# EasyEDA Pro project ProDoc_MotherBrd_2025-10-13.epro, board PCB1
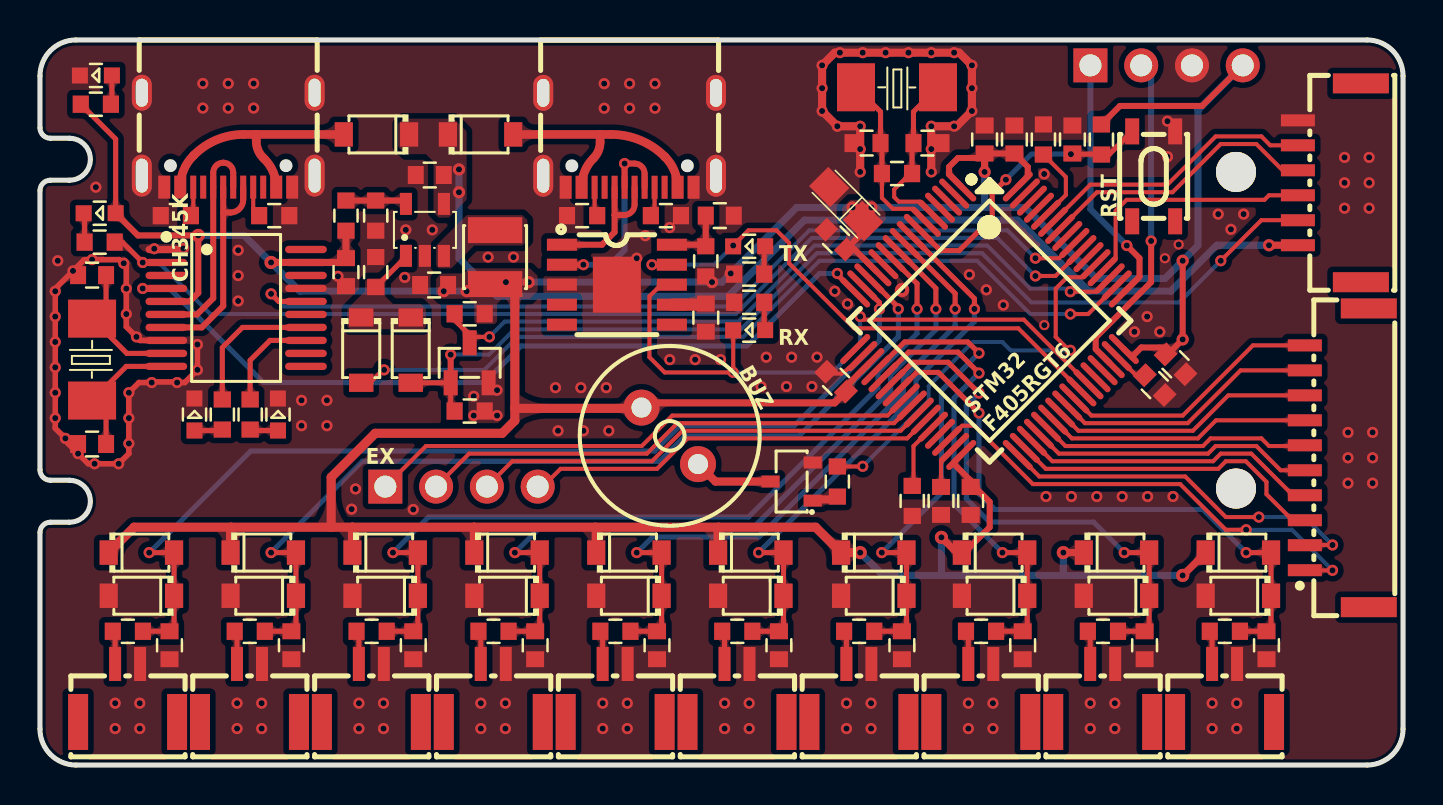
[diagram p1: board, top side]
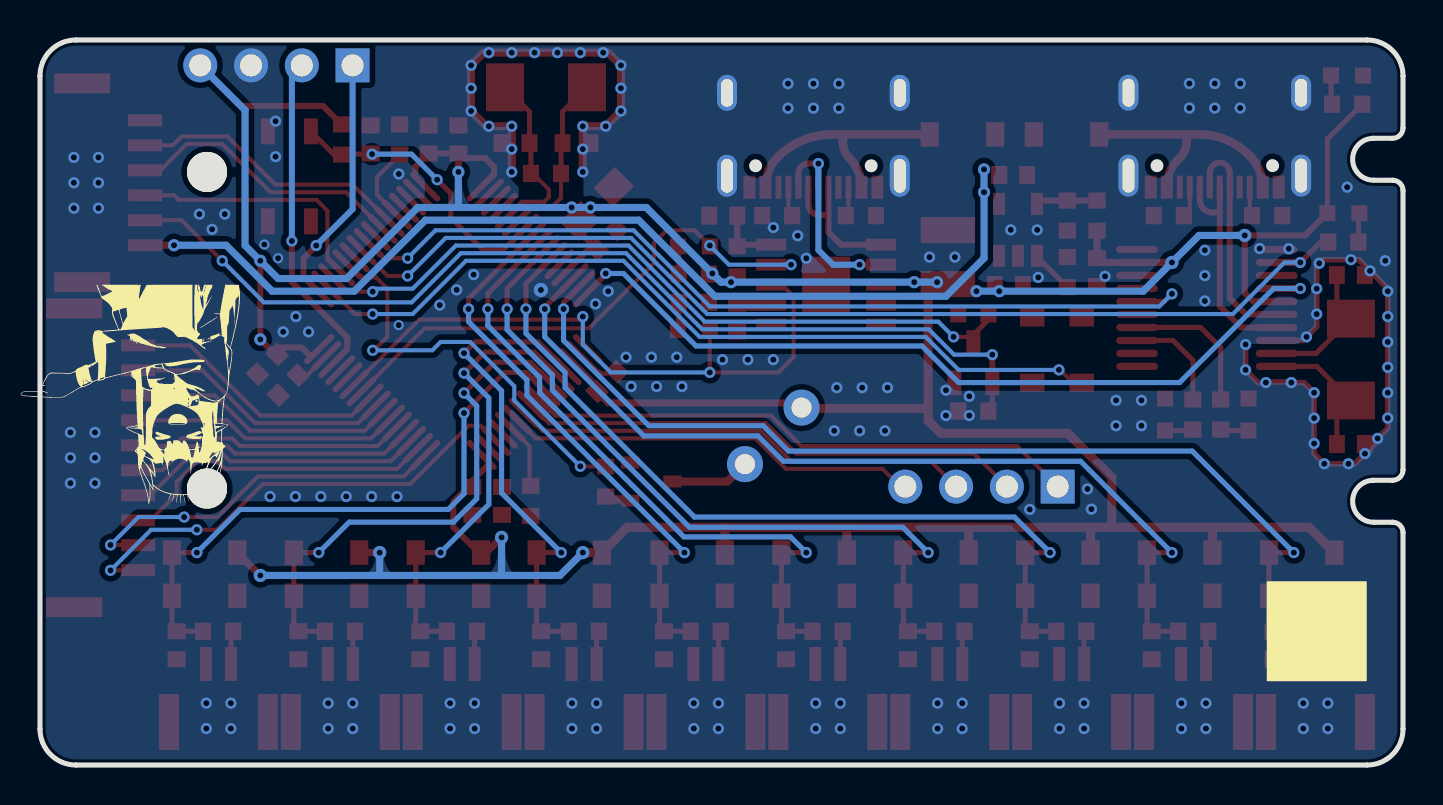
[diagram p2: board, bottom side, seen from below]

Outline 68.17 x 36.28 mm; copper layers: Top Layer, Bottom Layer. Coordinates in mm from the lower left corner of the outline.
Outline path: 0,34.48 0,31.89 arc(0.15,31.52) 0.52,31.37 1.47,31.37 arc(2.52,30.32) 1.47,29.27 0.52,29.27 arc(0.15,29.11) 0,28.75 0,14.77 arc(0.15,14.4) 0.52,14.25 1.47,14.25 arc(2.52,13.2) 1.47,12.15 0.52,12.15 arc(0.15,12) 0,11.63 0,1.8 arc(0.53,0.53) 1.8,0 66.37,0 arc(67.64,0.53) 68.17,1.8 68.17,34.48 arc(67.64,35.76) 66.37,36.28 1.8,36.28 arc(0.53,35.76) 0,34.48
Stack: Top Layer 0.035mm / Dielectric1 1.51mm FR4 er 4.5 / Bottom Layer 0.035mm

## Design rules (mm)
net OSC_IN: DP1
net OSC_OUT: DP1
net $1N4523: DP2
net $1N4525: DP2
template: 自定义配置
spacing copperThickness1oz (default): track to track 0.102, other pairs 0.152 to 0.3
spacing copperThickness2oz: track to track 0.203, other pairs 0.152 to 0.3
track width copperThickness1oz (default): min 0.127, default 0.254, max 2.54
track width copperThickness2oz: min 0.203, default 0.254, max 2.54
differential pair differentialPair (default): width min 0.127, default 0.254, max 2.54; gap min 0.152, default 0.152
via viaSize (default): diameter min 0.5, default 0.61, max 10; hole min 0.3, default 0.305, max 6.3

## Placement (name value [footprint] x y rotation side)
BUZ  2.7kHz  [BUZ-TH_BD9.0-P4.00-D0.6-FD]  31.5 16.47 315 top
C1  2.2uF  [C0603]  45.06 13.22 270 top
C2  2.2uF  [C0603]  55.75 19.01 315 top
C3  22pF  [C0603]  44.39 31.12 180 top
C4  22pF  [C0603]  41.34 31.12 0 top
C5  10uF  [C0603]  51.64 31.3 90 top
C6  100nF  [C0603]  47.24 31.3 270 top
C7  100nF  [C0603]  39.81 19.19 315 top
C8  100nF  [C0603]  46.55 13.22 90 top
C9  100nF  [C0603]  56.79 20.05 135 top
C10  100nF  [C0603]  48.73 31.3 270 top
C11  1uF  [CASE-A_3216]  40.32 28.08 135 top
C12  100nF  [C0603]  39.81 26.3 315 top
C13  22uF  [C0603]  19.49 29.53 0 top
C14  22uF  [C0603]  19.71 24.02 0 top
C15  22pF  [C0603]  2.61 24.52 0 top
C16  22pF  [C0603]  2.61 16.06 0 top
C17  100nF  [C0603]  15.3 24.67 270 top
C18  100nF  [C0603]  34 27.49 180 top
C19  100nF  [C0603]  33.3 22.39 90 top
C20  22nF  [C0603]  36.96 5.99 90 top
C21  22nF  [C0603]  61.34 5.99 90 top
C22  22nF  [C0603]  55.25 5.99 90 top
C23  22nF  [C0603]  49.15 5.99 90 top
C24  22nF  [C0603]  43.11 5.99 90 top
C25  22nF  [C0603]  6.48 5.99 90 top
C26  22nF  [C0603]  12.57 5.99 90 top
C27  22nF  [C0603]  18.67 5.99 90 top
C28  22nF  [C0603]  24.76 5.99 90 top
C29  22nF  [C0603]  30.86 5.99 90 top
C.HIHAT  -  [CONN-TH_2P-P1.25_XUNPU_WAFER-GH1.25-2PWB]  47.05 3.61 0 top
CH345K  -  [SSOP-20_L7.2-W5.3-P0.65-LS7.8-BL]  9.81 22.87 270 top
CRUSH  -  [CONN-TH_2P-P1.25_XUNPU_WAFER-GH1.25-2PWB]  53.15 3.61 0 top
D1  1N5819W S4  [SOD-123_L2.7-W1.6-LS3.7-RD]  16.83 31.56 180 top
D2  1N5819W S4  [SOD-123_L2.7-W1.6-LS3.7-RD]  22.03 31.56 0 top
D3  1N5819W S4  [SOD-123_L2.7-W1.6-LS3.7-RD]  18.54 20.76 270 top
D4  1N5819W S4  [SOD-123_L2.7-W1.6-LS3.7-RD]  16.07 20.76 270 top
D5  1N5819W S4  [SOD-123_L2.7-W1.6-LS3.7-RD]  35.55 10.63 0 top
D6  1N5819W S4  [SOD-123_L2.7-W1.6-LS3.7-RD]  35.55 8.47 180 top
D7  1N5819W S4  [SOD-123_L2.7-W1.6-LS3.7-RD]  59.93 10.63 0 top
D8  1N5819W S4  [SOD-123_L2.7-W1.6-LS3.7-RD]  59.93 8.47 180 top
D9  1N5819W S4  [SOD-123_L2.7-W1.6-LS3.7-RD]  53.84 10.63 0 top
D10  1N5819W S4  [SOD-123_L2.7-W1.6-LS3.7-RD]  53.84 8.47 180 top
D11  1N5819W S4  [SOD-123_L2.7-W1.6-LS3.7-RD]  47.74 10.63 0 top
D12  1N5819W S4  [SOD-123_L2.7-W1.6-LS3.7-RD]  47.74 8.47 180 top
D13  1N5819W S4  [SOD-123_L2.7-W1.6-LS3.7-RD]  41.7 10.63 0 top
D14  1N5819W S4  [SOD-123_L2.7-W1.6-LS3.7-RD]  41.7 8.47 180 top
D15  1N5819W S4  [SOD-123_L2.7-W1.6-LS3.7-RD]  5.07 10.63 0 top
D16  1N5819W S4  [SOD-123_L2.7-W1.6-LS3.7-RD]  5.07 8.47 180 top
D17  1N5819W S4  [SOD-123_L2.7-W1.6-LS3.7-RD]  11.17 10.63 0 top
D18  1N5819W S4  [SOD-123_L2.7-W1.6-LS3.7-RD]  11.17 8.47 180 top
D19  1N5819W S4  [SOD-123_L2.7-W1.6-LS3.7-RD]  17.26 10.63 0 top
D20  1N5819W S4  [SOD-123_L2.7-W1.6-LS3.7-RD]  17.26 8.47 180 top
D21  1N5819W S4  [SOD-123_L2.7-W1.6-LS3.7-RD]  23.36 10.63 0 top
D22  1N5819W S4  [SOD-123_L2.7-W1.6-LS3.7-RD]  23.36 8.47 180 top
D23  1N5819W S4  [SOD-123_L2.7-W1.6-LS3.7-RD]  29.45 10.63 0 top
D24  1N5819W S4  [SOD-123_L2.7-W1.6-LS3.7-RD]  29.45 8.47 180 top
EX  -  [HDR-TH_4P-P2.54-V-F]  21.08 13.93 0 top
FL. TOM  -  [CONN-TH_2P-P1.25_XUNPU_WAFER-GH1.25-2PWB]  4.38 3.61 0 top
HI. TOM  -  [CONN-TH_2P-P1.25_XUNPU_WAFER-GH1.25-2PWB]  16.57 3.61 0 top
KICK  WAFER-GH1.25-2PWB  [CONN-TH_2P-P1.25_XUNPU_WAFER-GH1.25-2PWB]  28.77 3.61 0 top
L1  2.2uH  [IND-SMD_L3.0-W3.0_FNR30XXS]  22.76 25.42 90 top
MID TOM  -  [CONN-TH_2P-P1.25_XUNPU_WAFER-GH1.25-2PWB]  10.48 3.61 0 top
MIN  -  [LED0603]  11.91 17.49 270 top
MOUT  -  [LED0603]  7.73 17.49 270 top
O.HIHAT  -  [CONN-TH_2P-P1.25_XUNPU_WAFER-GH1.25-2PWB]  40.96 3.61 0 top
PAD_OUT  -  [CONN-SMD_10P-P1.25_XUNPU_WAFER-GH1.25-10PWB]  64.86 15.38 90 top
PWR  -  [LED0603]  2.85 34.51 0 top
Q1  AO3400  [SOT-23-3_L2.9-W1.3-P1.90-LS2.4-BR]  21.49 20.13 270 top
Q2  S9013  [SOT-23-3_L2.9-W1.4-P1.90-LS2.6-BR]  37.59 14.19 0 top
QR  -  [JLC-QRCODE-5x5]  4.32 6.69 180 bottom
R1  10K  [R0603]  50.19 31.3 90 top
R2  10K  [R0603]  43.62 13.22 90 top
R3  10K  [R0603]  53.09 31.3 270 top
R4  1M  [R0603]  42.86 29.6 0 top
R5  100K  [R0603]  16.79 24.67 270 top
R6  453K  [R0603]  15.3 27.49 270 top
R7  100K  [R0603]  16.79 27.49 90 top
R8  100K  [R0603]  21.49 22.58 0 top
R9  10K  [R0603]  21.49 17.72 180 top
R10  4.7K  [R0603]  2.79 33.07 180 top
R11  5.1K  [R0603]  6.79 27.49 180 top
R12  5.1K  [R0603]  11.71 27.49 0 top
R13  2K  [R0603]  2.98 26.17 0 top
R14  1K  [R0603]  9.12 17.54 270 top
R15  1K  [R0603]  10.51 17.54 270 top
R16  5.1K  [R0603]  27.11 27.49 180 top
R17  5.1K  [R0603]  31.31 27.49 0 top
R18  0Ω  [R0603]  33.3 25.21 90 top
R19  1K  [R0603]  35.47 24.57 180 top
R20  1K  [R0603]  35.47 23.16 180 top
R21  1K  [R0603]  39.88 14.19 270 top
R22  10K-68K  [R0603]  34.88 6.69 180 top
R23  10K-68K  [R0603]  59.26 6.69 180 top
R24  10K-68K  [R0603]  53.16 6.69 180 top
R25  10K-68K  [R0603]  47.07 6.69 180 top
R26  10K-68K  [R0603]  40.97 6.69 180 top
R27  10K-68K  [R0603]  4.39 6.69 180 top
R28  10K-68K  [R0603]  10.49 6.69 180 top
R29  10K-68K  [R0603]  16.59 6.69 180 top
R30  10K-68K  [R0603]  22.68 6.69 180 top
R31  10K-68K  [R0603]  28.78 6.69 180 top
RDY  -  [LED0603]  3.04 27.62 0 top
RIDE  WAFER-GH1.25-2PWB  [CONN-TH_2P-P1.25_XUNPU_WAFER-GH1.25-2PWB]  59.25 3.61 0 top
RST  K2-1808SN-A3SW-01  [SW-SMD_4P-L4.2-W3.3-P2.15-LS5.1]  55.7 29.46 90 top
RX  -  [LED0603]  35.52 21.77 0 top
S STICK  -  [CONN-TH_2P-P1.25_XUNPU_WAFER-GH1.25-2PWB]  34.86 3.61 0 top
SCREW1  -  [M2螺丝]  59.82 29.68 0 top
SCREW2  -  [M2螺丝]  59.82 13.84 0 top
SNARE  WAFER-GH1.25-2PWB  [CONN-TH_2P-P1.25_XUNPU_WAFER-GH1.25-2PWB]  22.67 3.61 0 top
STM32
F405RGT6  -  [LQFP-64_L10.0-W10.0-P0.50-LS12.0-BL]  47.49 22.23 225 top
SWD  -  [HDR-TH_4P-P2.54-V-F]  56.35 35.01 0 top
TX  -  [LED0603]  35.52 25.97 0 top
U2  TLV62568DBVR  [SOT-23-5_L3.0-W1.7-P0.95-LS2.8-BR]  19.25 26.78 270 top
U4  CH340K  [ESOP-10_L4.9-W3.9-P1.00-LS6.2-BL-EP]  28.85 24.04 270 top
UI  WAFER-GH1.25-6PWB  [CONN-SMD_6P-P1.25_XUNPU_WAFER-GH1.25-6PWB]  64.49 29.14 90 top
USB_MIDI  <-  -  [USB-C-SMD_TYPE-C16PIN]  9.41 31.28 180 top
USB_USART ->  -  [USB-C-SMD_TYPE-C16PIN]  29.49 31.28 180 top
X1  8MHz  [CRYSTAL-SMD_L5.0-W3.2]  42.86 33.92 0 top
X2  12MHz  [OSC-SMD_L5.0-W3.2]  2.61 20.29 270 top

## Footprints (pads in the part's own frame, mm; a bottom-side part is the same pattern mirrored in y, then rotated)
BUZ-TH_BD9.0-P4.00-D0.6-FD
  round 1.8 hole 1: 1(-2,0) 2(2,0)
C0603
  rect 0.8x0.9 smd: 1(-0.7,0) 2(0.7,0)
CASE-A_3216
  rect 1.5x1.359 smd: 1(-1.2,0) 2(1.2,0)
CONN-SMD_6P-P1.25_XUNPU_WAFER-GH1.25-6PWB
  rect 0.6x1.7 smd: 1(-3.125,1.575) 2(-1.875,1.575) 3(-0.625,1.575) 4(0.625,1.575) 5(1.875,1.575) 6(3.125,1.575)
  rect 1x2.8 smd: 7(4.975,-1.575) 8(-4.975,-1.575)
CONN-SMD_10P-P1.25_XUNPU_WAFER-GH1.25-10PWB
  rect 0.6x1.7 smd: 1(-5.625,1.6) 2(-4.375,1.6) 3(-3.125,1.6) 4(-1.875,1.6) 5(-0.625,1.6) 6(0.625,1.6) 7(1.875,1.6) 8(3.125,1.6) 9(4.375,1.6) 10(5.625,1.6)
  rect 1x2.8 smd: 11(7.475,-1.6) 12(-7.475,-1.6)
CONN-TH_2P-P1.25_XUNPU_WAFER-GH1.25-2PWB
  rect 0.6x1.7 smd: 1(-0.625,1.45) 2(0.625,1.45)
  rect 1x2.8 smd: 3(-2.475,-1.45) 4(2.475,-1.45)
CRYSTAL-SMD_L5.0-W3.2
  rect 1.9x2.4 smd: 1(-2.05,0) 2(2.05,0)
ESOP-10_L4.9-W3.9-P1.00-LS6.2-BL-EP
  rect 0.6x1.5 smd: 1(-2,-2.75) 2(-1,-2.75) 3(0,-2.75) 4(1,-2.75) 5(2,-2.75) 6(2,2.75) 7(1,2.75) 8(0,2.75) 9(-1,2.75) 10(-2,2.75)
  rect 2.8x2.4 smd: 11(0,0)
HDR-TH_4P-P2.54-V-F
  rect 1.7x1.7 hole 1.1: 1(-3.81,0)
  round 1.7 hole 1.1: 2(-1.27,0) 3(1.27,0) 4(3.81,0)
IND-SMD_L3.0-W3.0_FNR30XXS
  rect 1.3x2.72 smd: 1(1.35,0) 2(-1.35,0)
LED0603
  rect 0.8x0.8 smd: 1(-0.851,-0.01) 2(0.75,-0.005)
LQFP-64_L10.0-W10.0-P0.50-LS12.0-BL
  oval 0.3x2 smd: 1(-3.75,-5.75) 2(-3.25,-5.75) 3(-2.75,-5.75) 4(-2.25,-5.75) 5(-1.75,-5.75) 6(-1.25,-5.75) 7(-0.75,-5.75) 8(-0.25,-5.75) 9(0.25,-5.75) 10(0.75,-5.75) 11(1.25,-5.75) 12(1.75,-5.75) 13(2.25,-5.75) 14(2.75,-5.75) 15(3.25,-5.75) 16(3.75,-5.75) 33(3.75,5.75) 34(3.25,5.75) 35(2.75,5.75) 36(2.25,5.75) 37(1.75,5.75) 38(1.25,5.75) 39(0.75,5.75) 40(0.25,5.75) 41(-0.25,5.75) 42(-0.75,5.75) 43(-1.25,5.75) 44(-1.75,5.75) 45(-2.25,5.75) 46(-2.75,5.75) 47(-3.25,5.75) 48(-3.75,5.75)
  oval 2x0.3 smd: 17(5.75,-3.75) 18(5.75,-3.25) 19(5.75,-2.75) 20(5.75,-2.25) 21(5.75,-1.75) 22(5.75,-1.25) 23(5.75,-0.75) 24(5.75,-0.25) 25(5.75,0.25) 26(5.75,0.75) 27(5.75,1.25) 28(5.75,1.75) 29(5.75,2.25) 30(5.75,2.75) 31(5.75,3.25) 32(5.75,3.75) 49(-5.75,3.75) 50(-5.75,3.25) 51(-5.75,2.75) 52(-5.75,2.25) 53(-5.75,1.75) 54(-5.75,1.25) 55(-5.75,0.75) 56(-5.75,0.25) 57(-5.75,-0.25) 58(-5.75,-0.75) 59(-5.75,-1.25) 60(-5.75,-1.75) 61(-5.75,-2.25) 62(-5.75,-2.75) 63(-5.75,-3.25) 64(-5.75,-3.75)
M2螺丝
  round 2 hole 2: 1(0,0)
OSC-SMD_L5.0-W3.2
  rect 1.9x2.4 smd: 1(-2.05,0) 2(2.05,0)
R0603
  rect 0.806x0.864 smd: 1(-0.753,0) 2(0.753,0)
SOD-123_L2.7-W1.6-LS3.7-RD
  rect 0.91x1.22 smd: 1(-1.635,0) 2(1.635,0)
SOT-23-3_L2.9-W1.3-P1.90-LS2.4-BR
  rect 1.25x0.7 smd: 1(1,-0.95) 2(1,0.95) 3(-1,0)
SOT-23-3_L2.9-W1.4-P1.90-LS2.6-BR
  rect 0.91x0.6 smd: 1(1.055,-0.955) 2(1.055,0.955) 3(-1.055,0)
SOT-23-5_L3.0-W1.7-P0.95-LS2.8-BR
  rect 1.1x0.6 smd: 1(1.3,-0.95) 2(1.3,0) 3(1.3,0.95) 4(-1.3,0.95) 5(-1.3,-0.95)
SSOP-20_L7.2-W5.3-P0.65-LS7.8-BL
  oval 0.364x2.082 smd: 1(-2.925,-3.491) 2(-2.275,-3.491) 3(-1.625,-3.491) 4(-0.975,-3.491) 5(-0.325,-3.491) 6(0.325,-3.491) 7(0.975,-3.491) 8(1.625,-3.491) 9(2.275,-3.491) 10(2.925,-3.491) 11(2.925,3.491) 12(2.275,3.491) 13(1.625,3.491) 14(0.975,3.491) 15(0.325,3.491) 16(-0.325,3.491) 17(-0.975,3.491) 18(-1.625,3.491) 19(-2.275,3.491) 20(-2.925,3.491)
SW-SMD_4P-L4.2-W3.3-P2.15-LS5.1
  rect 1.3x0.7 smd: 1(-2.25,1.075) 2(2.25,1.075) 3(-2.25,-1.075) 4(2.25,-1.075)
USB-C-SMD_TYPE-C16PIN
  oval 1x2.1 hole 0.6x1.7: 1(-4.32,1.788) 2(4.32,1.788)
  oval 1x1.8 hole 0.6x1.4: 3(-4.32,-2.362) 4(4.32,-2.362)
  rect 0.6x1.15 smd: A1B12(-3.2,2.362) A4B9(-2.4,2.362) B1A12(3.2,2.362) B4A9(2.4,2.362)
  rect 0.3x1.15 smd: A5(-1.25,2.362) A6(-0.25,2.362) A7(0.25,2.362) A8(1.25,2.362) B5(1.75,2.362) B6(0.75,2.362) B7(-0.75,2.362) B8(-1.75,2.362)

## Nets
3V3: BUZ.1 C6.2 C7.2 C8.2 C9.2 C10.2 C11.1 C12.2 C14.2 C17.1 C19.2 CH345K.5 CH345K.19 D5.1 D7.1 D9.1 D11.1 D13.1 D15.1 D17.1 D19.1 D21.1 D23.1 L1.2 R3.1 R6.2 R8.2 R10.2 R18.1 R19.2 R20.2 RDY.2 STM32
F405RGT6.1 STM32
F405RGT6.13 STM32
F405RGT6.19 STM32
F405RGT6.32 STM32
F405RGT6.48 STM32
F405RGT6.64 SWD.4 U4.7
5V: C13.2 D1.1 D2.1 U2.4 UI.1
5V_MIDI: D1.2 USB_MIDI  <-.A4B9 USB_MIDI  <-.B4A9
5V_USART: D2.2 USB_USART ->.A4B9 USB_USART ->.B4A9
GND: C1.2 C2.2 C3.1 C4.1 C5.2 C6.1 C7.1 C8.1 C9.1 C10.1 C11.2 C12.1 C13.1 C14.1 C15.1 C16.1 C17.2 C18.1 C19.1 C20.1 C21.1 C22.1 C23.1 C24.1 C25.1 C26.1 C27.1 C28.1 C29.1 C.HIHAT.2 CH345K.1 CH345K.8 CH345K.17 CRUSH.2 D6.2 D8.2 D10.2 D12.2 D14.2 D16.2 D18.2 D20.2 D22.2 D24.2 FL. TOM.2 HI. TOM.2 KICK.2 MID TOM.2 MIN.1 MOUT.1 O.HIHAT.2 PWR.1 Q1.2 Q2.2 R1.2 R2.1 R5.1 R7.1 R9.1 R11.2 R12.2 R16.2 R17.2 RIDE.2 RST.4 S STICK.2 SNARE.2 STM32
F405RGT6.12 STM32
F405RGT6.18 STM32
F405RGT6.63 SWD.3 U2.2 U4.3 U4.11 UI.6 USB_MIDI  <-.1 USB_MIDI  <-.2 USB_MIDI  <-.3 USB_MIDI  <-.4 USB_MIDI  <-.A1B12 USB_MIDI  <-.B1A12 USB_USART ->.1 USB_USART ->.2 USB_USART ->.3 USB_USART ->.4 USB_USART ->.A1B12 USB_USART ->.B1A12
ADC1_IN4: C24.2 D13.2 D14.1 R26.1 STM32
F405RGT6.20
ADC1_IN5: C23.2 D11.2 D12.1 R25.1 STM32
F405RGT6.21
ADC1_IN6: C22.2 D9.2 D10.1 R24.1 STM32
F405RGT6.22
ADC1_IN7: C21.2 D7.2 D8.1 R23.1 STM32
F405RGT6.23
ADC2_IN10: C20.2 D5.2 D6.1 R22.1 STM32
F405RGT6.8
ADC2_IN11: C29.2 D23.2 D24.1 R31.1 STM32
F405RGT6.9
ADC2_IN12: C28.2 D21.2 D22.1 R30.1 STM32
F405RGT6.10
ADC2_IN13: C27.2 D19.2 D20.1 R29.1 STM32
F405RGT6.11
ADC3_IN0: C26.2 D17.2 D18.1 R28.1 STM32
F405RGT6.14
ADC3_IN1: C25.2 D15.2 D16.1 R27.1 STM32
F405RGT6.15
BUZZER: R21.1 STM32
F405RGT6.53
CH340_UD+: U4.1 USB_USART ->.A6 USB_USART ->.B6
CH340_UD-: U4.2 USB_USART ->.A7 USB_USART ->.B7
CH345_ACK: CH345K.16 STM32
F405RGT6.56
CH345_UD+: CH345K.6 USB_MIDI  <-.A6 USB_MIDI  <-.B6
CH345_UD-: CH345K.7 USB_MIDI  <-.A7 USB_MIDI  <-.B7
CLOSEHIHAT_OUT: PAD_OUT.8 STM32
F405RGT6.39
CRASH_OUT: PAD_OUT.9 STM32
F405RGT6.40
GPIO_EXTI3: CH345K.2 R13.2 STM32
F405RGT6.55
HIGHTOM_OUT: PAD_OUT.4 STM32
F405RGT6.35
I2C1_SCL: STM32
F405RGT6.58 UI.4
I2C1_SDA: STM32
F405RGT6.59 UI.5
KEY: D3.2 Q1.1 R9.2 UI.2
KEY_PRESS: Q1.3 R8.1 STM32
F405RGT6.51
KICK_OUT: PAD_OUT.2 STM32
F405RGT6.33
LED: STM32
F405RGT6.52 UI.3
LED_MIDIIN: CH345K.13 R15.1
LED_MIDIOUT: CH345K.14 R14.1
LOWTOM_OUT: PAD_OUT.6 STM32
F405RGT6.37
MIDTOM_OUT: PAD_OUT.5 STM32
F405RGT6.36
OPENHIHAT_OUT: PAD_OUT.7 STM32
F405RGT6.38
OSC_IN: C3.2 R4.2 STM32
F405RGT6.5 X1.2
OSC_OUT: C4.2 R4.1 STM32
F405RGT6.6 X1.1
PB0: EX.3 STM32
F405RGT6.26
PB1: EX.4 STM32
F405RGT6.27
PC4: EX.1 STM32
F405RGT6.24
PC5: EX.2 STM32
F405RGT6.25
PWR_EN: D4.2 STM32
F405RGT6.50
RIDE_OUT: PAD_OUT.10 STM32
F405RGT6.41
RST: C5.1 R3.2 RST.2 STM32
F405RGT6.7
RX: RX.1 STM32
F405RGT6.43 U4.8
SERIAL_MOUT: CH345K.4 STM32
F405RGT6.16
SIDESTICK_OUT: PAD_OUT.1 STM32
F405RGT6.30
SNARE_OUT: PAD_OUT.3 STM32
F405RGT6.34
SWCLK: STM32
F405RGT6.49 SWD.1
SWDIO: STM32
F405RGT6.46 SWD.2
TLV_EN: D3.1 D4.1 R5.2 U2.1
TX: STM32
F405RGT6.42 TX.1 U4.9
$1N1371: C18.2 R18.2 U4.10
$1N1399: R16.1 USB_USART ->.B5
$1N1400: R17.1 USB_USART ->.A5
$1N1583: R12.1 USB_MIDI  <-.A5
$1N1586: R11.1 USB_MIDI  <-.B5
$1N2268: R1.1 STM32
F405RGT6.60
$1N2294: R2.2 STM32
F405RGT6.28
$1N4386: C1.1 STM32
F405RGT6.31
$1N4392: C2.1 STM32
F405RGT6.47
$1N4523: C15.2 CH345K.9 X2.1
$1N4525: C16.2 CH345K.10 X2.2
$1N4897: MOUT.2 R14.2
$1N4901: MIN.2 R15.2
$1N5032: R13.1 RDY.1
$1N6007: R6.1 R7.2 U2.5
$1N6012: L1.1 U2.3
$1N7140: BUZ.2 Q2.3
$1N7141: Q2.1 R21.2
$1N8066: R19.1 TX.2
$1N8071: R20.1 RX.2
$1N9517: PWR.2 R10.1
$1N12193: R22.2 S STICK.1
$1N12501: R23.2 RIDE.1
$1N12654: CRUSH.1 R24.2
$1N12806: C.HIHAT.1 R25.2
$1N12958: O.HIHAT.1 R26.2
$1N13110: FL. TOM.1 R27.2
$1N13262: MID TOM.1 R28.2
$1N13414: HI. TOM.1 R29.2
$1N13566: R30.2 SNARE.1
$1N13718: KICK.1 R31.2

Pads without a net: C.HIHAT 3 4; CH345K 3 11 12 15 18 20; CRUSH 3 4; FL. TOM 3 4; HI. TOM 3 4; KICK 3 4; MID TOM 3 4; O.HIHAT 3 4; PAD_OUT 11 12; RIDE 3 4; RST 1 3; S STICK 3 4; SCREW1 1; SCREW2 1; SNARE 3 4; STM32
F405RGT6 2 3 4 17 29 44 45 54 57 61 62; U4 4 5 6; UI 7 8; USB_MIDI  <- A8 B8; USB_USART -> A8 B8

## Via types
v1: diameter 0.66, hole 0.305, Top Layer to Bottom Layer, 6 vias
v2: diameter 0.61, hole 0.305, Top Layer to Bottom Layer, 14 vias
v3: diameter 0.559, hole 0.305, Top Layer to Bottom Layer, 217 vias
v4: diameter 0.711, hole 0.305, Top Layer to Bottom Layer, 1 via
v5: diameter 0.508, hole 0.305, Top Layer to Bottom Layer, 3 vias

## Routing (per net, layer and track width the routed paths; a pad name or vN(x,y) marks a point on that pad's centre or on a via; arc(x,y) is an arc through that point)
3V3: length 229.9
  Top Layer w0.254: RDY.2 3.78,31.33 R10.2
  Top Layer w0.299: SWD.4 58.12,32.98 54.01,32.98 R3.1 ; D11.1 46.23,10.63 47.5,11.9 47.5,13.17 46.55,14.12 46.55,14.23 45.73,15.05 45.73,15.17 STM32
F405RGT6.32 ; C11.1 41.17,26.66 C12.2 40.74,25.8 STM32
F405RGT6.13 ; STM32
F405RGT6.64 49.4,29.45 49.4,29.94 C10.2 C6.2 47.02,30.38 45.91,30.38 45.47,29.94 45.47,29.56 STM32
F405RGT6.1 ; STM32
F405RGT6.48 54.61,20.42 55.08,20.9 56.3,20.9 C9.2 56.4,20.55 v2(57.15,21.3) v2(57.15,25.24) ; 40.31,18.94 STM32
F405RGT6.19
  Top Layer w0.305: CH345K.5 7.49,23.2 7.91,23.63 v1(7.91,26.5) 4.9,26.5 RDY.2
  Top Layer w0.355: BUZ.1 30.32,18.12 39.74,18.12 C7.2 ; D11.1 45.85,10.63 v1(45.09,11.39) ; D7.1 57.16,9.49 v1(57.15,9.49) ; R6.2 C17.1 15.09,25.15 CH345K.19 v1(11.56,25.15) ; v2(47.24,29.68) C6.2 ; v2(41.58,27.9) 41.17,27.49 C11.1 ; D9.1 v1(51.18,10.63)
  Top Layer w0.457: 9.56,11.9 9.53,11.87 D17.1 ; 9.56,11.9 4.71,11.9 D15.1 ; 9.56,11.9 14.56,11.9 ; 23.75,17.87 23.75,24.07 L1.2 ; 23.75,17.87 23.75,17.23 23.11,16.6 16.76,16.6 14.56,14.4 14.56,11.9 ; 23.75,17.87 23.77,17.85 30.04,17.85 BUZ.1 ; 21.72,11.9 27.77,11.9 ; 21.72,11.9 21.72,11.9 D21.1 ; 21.72,11.9 15.63,11.9 ; 27.77,11.9 33.93,11.9 ; 27.77,11.9 27.82,11.86 D23.1 ; 33.93,11.9 38.8,11.9 D13.1 v1(41.02,10.63) ; 33.93,11.9 33.92,11.88 D5.1 ; 14.56,11.9 15.63,11.9 ; D19.1 15.63,11.9 15.63,11.9
  Top Layer w0.6: U4.7 33.25,23.04 C19.2
  Bottom Layer w0.355: v1(51.18,10.63) 51.18,9.49 51.17,9.49 ; 45.07,9.49 51.17,9.49 ; 45.07,9.49 42.16,9.49 v1(41.02,10.63) ; 45.07,9.49 45.09,9.5 v1(45.09,11.39) ; 51.17,9.49 v1(57.15,9.49) ; SWD.4 57.91,32.77 57.91,26 v2(57.15,25.24) 56.26,24.35 52.83,24.35 49.28,27.9 47.24,27.9 ; v2(23.3,24.17) v2(24.45,24.17) v2(33.61,24.17) 34.11,24.17 v2(34.54,24.6) 37.85,27.9 v2(40.64,27.9) v2(41.58,27.9) 47.24,27.9 ; 47.24,27.9 47.24,27.91 v2(47.24,29.68) ; v1(7.91,26.5) 10.2,26.5 v1(11.56,25.15) 12.99,23.71 v2(20.19,23.71) v2(21.34,23.71)
5V: length 51.2
  Top Layer w0.355: UI.1 v2(61.47,26.01)
  Bottom Layer w0.355: v2(20.96,29.81) v2(20.96,28.66) 20.96,25.36 22.86,23.46 34.42,23.46 38.23,27.27 48.9,27.27 52.45,23.71 56.56,23.71 58.86,26.01 v2(61.47,26.01)
5V_MIDI: length 12.5
  Top Layer w0.432: 10.81,31.56 10.19,31.56 arc(8.85,31.29) 7.71,30.53 7.66,30.48 arc(7.18,29.77) USB_MIDI  <-.B4A9 ; 10.81,31.56 10.81,31.23 arc(10.91,30.77) 11.16,30.39 11.24,30.32 arc(11.66,29.68) USB_MIDI  <-.A4B9 ; 10.81,31.56 D1.2
5V_USART: length 12.5
  Top Layer w0.432: USB_USART ->.B4A9 27.09,28.93 arc(27.24,29.71) 27.68,30.36 arc(27.93,30.73) 28.01,31.17 28.01,31.56 ; 28.01,31.56 28.56,31.56 arc(30.02,31.27) 31.25,30.44 31.26,30.44 arc(31.73,29.74) 31.89,28.92 USB_USART ->.A4B9 ; 28.01,31.56 D2.2
GND: length 53.4
  Top Layer w0.203: STM32
F405RGT6.18 40.6,19.95 arc(40.51,19.91) 40.43,19.84 arc(40.3,19.74) 40.16,19.65 arc(40.11,19.62) 40.07,19.59 39.55,19.59 arc(39.42,19.61) C7.1
  Top Layer w0.28: CH345K.8 5,21.25 v3(4.83,21.43) 4.32,21.93 v3(4.32,22.57) v3(4.32,23.84) 4.32,24.98 v3(4.19,25.11) 4.16,25.14 4.11,25.14 3.96,25.29 v3(2.61,25.29) 2.21,25.29 v3(1.65,24.73) 0.76,23.84 v3(0.76,23.71) v3(0.76,22.44) v3(0.76,21.17) v3(0.76,19.9) v3(0.76,18.63) v3(0.76,17.36) 0.76,16.85 v3(1.27,16.35) 1.27,16.22 v3(1.91,15.58) 2.41,15.08 v3(2.73,15.08) v3(3.94,15.08) 4.44,15.58 v3(4.44,16.09) v3(4.44,17.36) v3(4.44,18.63) 4.95,19.14 v3(5.59,19.14) 5.62,19.17 6.83,19.17 v3(6.86,19.14) 7.24,19.14 v3(7.87,19.77) v3(7.87,21.05)
  Top Layer w0.406: v3(41.02,29.68) v3(41.02,30.82) v3(41.02,31.97) v3(39.88,31.97) v3(39.12,32.73) v3(39.12,33.87) v3(39.12,35.02) 39.75,35.65 v3(41.15,35.65) v3(42.29,35.65) v3(43.43,35.65) v3(44.58,35.65) 45.97,35.65 v3(46.61,35.02) v3(46.61,33.87) v3(46.61,32.73) 45.85,31.97 v3(45.72,31.97) v3(44.58,31.97) v3(44.58,30.82) v3(44.58,29.68)
  vias: v3(0.89,25.24) v3(2.79,28.92) v3(3.76,3.09) v3(3.76,1.83) v3(4.99,3.09) v3(4.99,1.83) v3(5.71,25.84) v3(7.17,25.85) v3(8.14,34.11) v3(8.14,32.88) v3(9.41,34.11) v3(9.41,32.88) v3(9.91,25.76) v3(9.91,24.49) v3(9.91,23.22) v3(9.86,3.09) v3(9.86,1.83) v3(10.68,34.11) v3(10.68,32.88) v3(11.08,3.09) v3(11.08,1.83) v3(13.08,18.25) v3(13.08,16.98) v3(14.35,18.25) v3(14.35,16.98) v3(14.9,24.46) v3(15.59,12.8) v3(15.78,13.82) v3(15.95,3.09) v3(15.95,1.83) v3(17.18,3.09) v3(17.18,1.83) v3(18.24,24.4) v3(18.3,26.78) v3(18.67,12.79) v3(19.62,26.78) v3(21.69,18.45) v3(21.69,17.49) v3(22.05,3.09) v3(22.05,1.83) v3(22.41,25.42) v3(22.86,18.76) v3(22.86,17.49) v3(23.28,3.09) v3(23.28,1.83) v3(23.68,25.42) v3(25.78,18.89) v3(25.91,16.73) v3(27.05,18.89) v3(27.18,16.73) v3(28.14,3.09) v3(28.14,1.83) v3(28.22,34.1) v3(28.22,32.87) v3(28.32,18.89) v3(28.45,16.73) v3(29.37,3.09) v3(29.37,1.83) v3(29.49,34.1) v3(29.49,32.87) v3(29.84,25.36) v3(30.28,26.49) v3(30.76,34.1) v3(30.76,32.87) v3(31.49,26.9) v3(31.5,20.29) v3(32.77,20.29) v3(34.04,20.29) v3(34.24,3.09) v3(34.24,1.83) v3(35.47,3.09) v3(35.47,1.83) v3(36.07,18.94) v3(36.32,20.41) v3(37.34,18.94) v3(37.59,20.41) v3(38.61,18.94) v3(38.86,20.41) v3(39.75,23.71) v3(40,35.65) v3(40.34,3.09) v3(40.34,1.83) v3(40.39,23.08) v3(41.56,3.09) v3(41.56,1.83) v3(45.72,35.65) v3(46.43,3.09) v3(46.43,1.83) v3(46.48,24.54) v3(47.33,23.78) v3(47.66,3.09) v3(47.66,1.83) v3(48.18,23.02) v3(50.22,29.58) v3(50.31,13.44) v3(51.59,13.44) v3(52.53,3.09) v3(52.53,1.83) v3(52.85,13.44) v3(53.76,3.09) v3(53.76,1.83) v3(54.12,13.44) v3(54.74,21.68) v3(55.37,22.44) v3(55.4,13.44) v3(56.01,21.68) v3(56.39,32.22) v3(56.39,30.44) v3(56.66,13.44) v3(58.62,3.09) v3(58.62,1.83) v3(58.93,27.57) v3(59.56,26.81) v3(59.85,3.09) v3(59.85,1.83) v3(60.2,27.57) v3(65.25,30.41) v3(65.25,29.14) v3(65.25,27.87) v3(65.42,16.65) v3(65.42,15.38) v3(65.42,14.11) v3(66.47,30.41) v3(66.47,29.14) v3(66.47,27.87) v3(66.65,16.65) v3(66.65,15.38) v3(66.65,14.11) v4(43.12,23.77) v5(50.23,22.02) v5(56.26,25.36) v5(56.95,26.05)
ADC1_IN4: length 24.6
  Top Layer w0.254: R26.1 C24.2 43.34,6.92 D14.1 D13.2 42.1,10.63 42.1,10.63 ; 41.83,19.76 43.25,21.17 46.4,21.17 v3(46.96,20.61)
  Bottom Layer w0.254: v3(42.1,10.63) 45.09,13.62 45.09,18.73 v3(46.96,20.61)
ADC1_IN5: length 22.8
  Top Layer w0.254: v3(48.13,10.63) D11.2 D12.1 49.38,6.92 C23.2 R25.1 ; STM32
F405RGT6.21 43.44,20.66 45.91,20.66 v3(46.96,19.61)
  Bottom Layer w0.254: v3(48.13,10.63) 45.72,13.04 45.72,18.37 v3(46.96,19.61)
ADC1_IN6: length 26.7
  Top Layer w0.254: v3(46.96,18.61) 45.42,20.16 43.64,20.16 STM32
F405RGT6.22 ; v3(54.23,10.63) D9.2 D10.1 55.47,6.92 C22.2 R24.1
  Bottom Layer w0.254: v3(54.23,10.63) 52.71,12.16 47.5,12.16 46.33,13.33 46.33,17.98 v3(46.96,18.61)
ADC1_IN7: length 30.5
  Top Layer w0.254: v3(60.32,10.63) D7.2 D8.1 61.57,6.92 C21.2 R23.1 ; STM32
F405RGT6.23 43.84,19.65 44.93,19.65 v3(46.96,17.62)
  Bottom Layer w0.254: v3(60.32,10.63) 58.17,12.79 47.75,12.79 46.96,13.58 v3(46.96,17.62)
ADC2_IN10: length 28.2
  Top Layer w0.254: R22.1 C20.2 37.19,6.92 D6.1 D5.2 v3(35.94,10.63) ; STM32
F405RGT6.8 46.74,23.34 v3(46.74,22.82)
  Bottom Layer w0.254: v3(35.94,10.63) 43.81,18.5 43.81,19.27 46.74,22.19 v3(46.74,22.82)
ADC2_IN11: length 32.9
  Top Layer w0.254: R31.1 C29.2 31.09,6.92 D24.1 D23.2 v3(29.84,10.63) ; v3(45.77,22.82) 45.77,23.6 43.25,26.12
  Bottom Layer w0.254: v3(29.84,10.63) 30.63,11.42 35.97,11.42 43.18,18.63 43.18,19.39 45.77,21.98 v3(45.77,22.82)
ADC2_IN12: length 37.5
  Top Layer w0.254: v3(44.81,22.82) 44.81,23.86 42.89,25.77 ; v3(23.75,10.63) D21.2 D22.1 24.99,6.92 C28.2 R30.1
  Bottom Layer w0.254: v3(23.75,10.63) 25.02,11.9 35.69,11.9 42.54,18.76 42.54,19.52 44.81,21.78 v3(44.81,22.82)
ADC2_IN13: length 42.2
  Top Layer w0.254: v3(43.87,22.82) 43.87,24.09 STM32
F405RGT6.11 ; R29.1 C27.2 18.9,6.92 D20.1 D19.2 v3(17.65,10.63)
  Bottom Layer w0.254: v3(17.65,10.63) 19.43,12.41 35.43,12.41 41.91,18.89 41.91,19.65 43.87,21.6 v3(43.87,22.82)
ADC3_IN0: length 46
  Top Layer w0.254: v3(11.56,10.63) D17.2 D18.1 12.8,6.92 C26.2 R28.1 ; 41.48,24.36 42.93,22.91 v3(42.93,22.82)
  Bottom Layer w0.254: v3(11.56,10.63) 16.13,15.2 30.99,15.2 32.26,16.47 37.97,16.47 42.93,21.43 v3(42.93,22.82)
ADC3_IN1: length 50.6
  Top Layer w0.254: v3(41.99,22.82) 41.99,23.14 STM32
F405RGT6.15 ; v3(5.46,10.63) D15.2 D16.1 6.71,6.92 C25.2 R27.1
  Bottom Layer w0.254: v3(5.46,10.63) 10.54,15.71 30.73,15.71 32,16.98 37.72,16.98 41.99,21.25 v3(41.99,22.82)
BUZZER: length 20.7
  Top Layer w0.203: v3(51.53,20.75) 51.47,20.75 50.8,21.43 50.8,23.84 51.37,24.41 52.14,24.41 STM32
F405RGT6.53 ; v3(41.15,14.95) 41.14,14.94 R21.1
  Bottom Layer w0.203: v3(51.53,20.75) 48.55,20.75 48.13,21.17 46.66,21.17 44.45,18.96 44.45,18.25 v3(41.15,14.95)
CH340_UD+: length 7.3
  Top Layer w0.299: U4.1 28.11,26.04 28.74,26.67 28.74,27.53 ; 28.74,27.53 USB_USART ->.B6 ; 28.74,27.53 arc(28.74,27.52) 28.74,27.52 29.21,27.52 arc(29.58,27.68) 29.74,28.05 USB_USART ->.A6
CH340_UD-: length 10.9
  Top Layer w0.299: U4.2 v3(27.18,25.04) ; USB_USART ->.A7 v3(29.24,30.1) 29.74,30.1 arc(30.09,29.95) 30.24,29.6 USB_USART ->.B7
  Bottom Layer w0.299: v3(29.24,30.1) 29.24,25.77 28.5,25.04 v3(27.18,25.04)
CH345_ACK: length 44.8
  Top Layer w0.203: STM32
F405RGT6.56 50.97,25.36 v3(49.78,25.36)
  Top Layer w0.254: v3(11.56,23.58) 11.94,23.2 CH345K.16
  Bottom Layer w0.203: v3(49.78,25.36) 48.39,26.76 38.48,26.76 34.67,22.95 12.19,22.95 v3(11.56,23.58)
CH345_UD+: length 11.3
  Top Layer w0.299: CH345K.6 7.85,22.55 8.66,23.36 USB_MIDI  <-.B6 8.66,29.64 arc(8.81,30) 9.17,30.14 arc(9.52,30) 9.66,29.65 USB_MIDI  <-.A6
CH345_UD-: length 11.2
  Top Layer w0.299: USB_MIDI  <-.A7 9.16,27.63 ; 9.16,27.63 9.16,22.97 8.09,21.9 CH345K.7 ; 9.16,27.63 arc(9.17,27.64) 9.18,27.65 9.53,27.65 arc(9.98,27.84) 10.16,28.29 USB_MIDI  <-.B7
CLOSEHIHAT_OUT: length 13.3
  Top Layer w0.203: 51.03,17.64 51.94,16.73 57.66,16.73 59.43,18.5 PAD_OUT.8
CRASH_OUT: length 13.3
  Top Layer w0.203: PAD_OUT.9 60.05,19.75 57.4,17.11 52.26,17.11 51.38,17.99
GPIO_EXTI3: length 53.9
  Top Layer w0.203: 52.09,25.77 50.79,24.47 v3(49.78,24.47)
  Top Layer w0.254: R13.2 4.12,26.17 v3(5.14,25.15) CH345K.2
  Bottom Layer w0.203: v3(5.14,25.15) 5.93,25.15 8.51,22.57 34.8,22.57 38.61,26.38 47.88,26.38 v3(49.78,24.47)
HIGHTOM_OUT: length 15.1
  Top Layer w0.203: PAD_OUT.4 62.66,13.5 60.58,15.58 59.06,15.58 58.67,15.2 50.63,15.2 STM32
F405RGT6.35
I2C1_SCL: length 14.2
  Top Layer w0.203: 51.03,26.83 52.86,28.66 56.64,28.66 59.06,31.08 60.83,31.08 62.15,29.76 UI.4
I2C1_SDA: length 14.2
  Top Layer w0.203: UI.5 61.53,31.01 61.09,31.46 58.8,31.46 56.39,29.05 52.53,29.05 STM32
F405RGT6.59
KEY: length 52.1
  Top Layer w0.203: v3(59.06,25.24) 61.09,27.27 62.91,27.27 UI.2
  Top Layer w0.254: R9.2 20.54,17.91 Q1.1 18.54,19.13
  Top Layer w0.299: Q1.1 v3(20.54,20.54)
  Bottom Layer w0.203: v3(20.54,20.54) 22.45,20.54 23.72,21.81 35.05,21.81 38.86,25.62 47.12,25.62 49.58,23.15 56.97,23.15 v3(59.06,25.24)
KEY_PRESS: length 37
  Top Layer w0.203: v3(22.48,21.43) 21.59,21.43 21.49,21.53 ; 53.5,24.36 52.83,23.69 v3(51.53,23.69)
  Top Layer w0.254: R8.1 20.74,22.28 21.49,21.53 Q1.3
  Bottom Layer w0.203: v3(22.48,21.43) 23.24,22.19 34.93,22.19 38.74,26 47.37,26 49.53,23.84 51.53,23.84 v3(51.53,23.69)
KICK_OUT: length 19
  Top Layer w0.203: v3(60.96,12.41) 59.31,12.41 57.28,14.44 49.98,14.44 STM32
F405RGT6.33 ; PAD_OUT.2 63.27,11.01 v3(64.64,11.01)
  Bottom Layer w0.203: v3(64.64,11.01) 63.25,12.41 v3(60.96,12.41)
LED: length 12.7
  Top Layer w0.203: UI.3 61.47,28.51 61.24,28.28 54.34,28.28 53.8,27.74 53.8,25.36 STM32
F405RGT6.52
LED_MIDIIN: length 5.2
  Top Layer w0.254: R15.1 10.51,20.25 11.51,21.25 CH345K.13
LED_MIDIOUT: length 7.2
  Top Layer w0.254: R14.1 9.12,20.89 10.13,21.9 CH345K.14
LOWTOM_OUT: length 13.7
  Top Layer w0.203: PAD_OUT.6 63.22,15.97 61.47,15.97 61.09,16.35 58.55,16.35 58.17,15.97 51.28,15.97 STM32
F405RGT6.37
MIDTOM_OUT: length 14.4
  Top Layer w0.203: STM32
F405RGT6.36 50.96,15.58 58.42,15.58 58.8,15.97 60.83,15.97 62.05,14.75 PAD_OUT.5
OPENHIHAT_OUT: length 13.4
  Top Layer w0.203: STM32
F405RGT6.38 51.61,16.35 57.91,16.35 58.82,17.25 PAD_OUT.7
OSC_IN: length 8.8
  Top Layer w0.203: R4.2 43.52,29.6 42.72,28.81 42.72,28.42 42.95,28.19 44.01,28.19 44.66,27.54
  Top Layer w0.254: X1.2 43.69,32.69 C3.2 43.62,31.05 R4.2
OSC_OUT: length 8.8
  Top Layer w0.203: STM32
F405RGT6.6 43.66,27.84 42.65,27.84 42.11,28.38 R4.1
  Top Layer w0.254: X1.1 42.04,32.69 C4.2 42.11,31.05 R4.1
PB0: length 23.1
  Top Layer w0.203: EX.3 23.62,15.2 30.61,15.2 32.13,16.73 43.04,16.73 STM32
F405RGT6.26
PB1: length 20.8
  Top Layer w0.203: EX.4 25.15,13.93 26.03,14.82 30.86,14.82 32.38,16.35 43.37,16.35 STM32
F405RGT6.27
PC4: length 27.8
  Top Layer w0.203: EX.1 19.3,15.97 30.1,15.97 31.62,17.49 42.39,17.49 43.25,18.35
PC5: length 25.5
  Top Layer w0.203: 43.6,17.99 42.72,17.11 31.88,17.11 30.35,15.58 21.46,15.58 EX.2
PWR_EN: length 42
  Top Layer w0.203: 16.07,19.13 16.5,19.13 17.14,19.77 v3(17.21,19.77) ; STM32
F405RGT6.50 52.42,22.57 v3(51.53,22.57)
  Bottom Layer w0.203: v3(17.21,19.77) 22.22,19.77 23.88,21.43 35.18,21.43 38.99,25.24 46.86,25.24 49.53,22.57 v3(51.53,22.57)
RIDE_OUT: length 13.3
  Top Layer w0.203: PAD_OUT.10 60.66,21 57.15,17.49 52.59,17.49 STM32
F405RGT6.41
RST: length 14.3
  Top Layer w0.254: v3(48.31,29.29) 47.62,28.61 47.62,27.39 45.97,25.74 45.04,25.74 STM32
F405RGT6.7 ; RST.2 53.47,30.55 R3.2 53.07,30.57 v3(51.56,30.57)
  Bottom Layer w0.254: v3(48.31,29.29) 49.59,30.57 v3(51.56,30.57)
RX: length 32.2
  Top Layer w0.203: v3(41.02,22.44) 41.17,22.29 49.2,22.29 STM32
F405RGT6.43 ; RX.1 34.67,21.76 v3(34.67,19.65) 31.24,19.65 30.48,20.41 30.48,23.46 31.06,24.04 U4.8
  Bottom Layer w0.203: v3(34.67,19.65) 39.62,19.65 41.02,21.05 v3(41.02,22.44)
SERIAL_MOUT: length 41.5
  Top Layer w0.254: v3(39.88,24.6) 39.88,24.54 STM32
F405RGT6.16 ; CH345K.4 v3(5.14,23.85)
  Bottom Layer w0.254: v3(5.14,23.85) 6.47,23.85 11.18,19.14 22.22,19.14 24.06,20.97 35.36,20.97 38.99,24.6 v3(39.88,24.6)
SIDESTICK_OUT: length 24
  Top Layer w0.203: v3(60.32,11.77) 59.31,11.77 57.02,14.06 49.66,14.06 46.74,16.98 46.12,16.98 STM32
F405RGT6.30 ; v3(64.64,9.74) 63.27,9.74 PAD_OUT.1
  Bottom Layer w0.203: v3(64.64,9.74) 62.61,11.77 v3(60.32,11.77)
SNARE_OUT: length 16.2
  Top Layer w0.203: PAD_OUT.3 62.64,12.25 61.34,13.55 61.34,14.17 60.31,15.2 59.31,15.2 58.93,14.82 50.31,14.82 49.26,15.87
SWCLK: length 12.7
  Top Layer w0.299: STM32
F405RGT6.49 54.99,24.43 54.99,25.36 v3(54.36,26)
  Bottom Layer w0.299: SWD.1 52.54,27.82 v3(54.36,26)
SWDIO: length 16.5
  Top Layer w0.299: v3(55.57,26.23) 55.57,24.17 52.8,21.39 52.8,20.81 STM32
F405RGT6.46
  Bottom Layer w0.299: SWD.2 55.57,34.52 v3(55.57,26.23)
TLV_EN: length 2.2
  Top Layer w0.254: U2.1 18.3,25.43 16.79,23.91
TX: length 27.1
  Top Layer w0.203: v3(34.67,26) 35.43,26.76 36.83,26.76 37.47,26.12 37.47,25.11 40.72,21.86 48.93,21.86 STM32
F405RGT6.42
  Top Layer w0.254: U4.9 v3(30.61,25.04)
  Bottom Layer w0.203: v3(30.61,25.04) 33.71,25.04 v3(34.67,26)
$1N1371: length 3.3
  Top Layer w0.305: C18.2 R18.2 33.22,26.04 U4.10
$1N1399: length 1.5
  Top Layer w0.203: USB_USART ->.B5 27.74,27.62 R16.1
$1N1400: length 1.5
  Top Layer w0.203: R17.1 30.74,27.68 USB_USART ->.A5
$1N1583: length 1.5
  Top Layer w0.203: USB_MIDI  <-.A5 10.66,27.57 10.74,27.49
$1N1586: length 1.5
  Top Layer w0.203: R11.1 7.66,27.61 USB_MIDI  <-.B5
$1N2268: length 3.9
  Top Layer w0.203: R1.1 51.31,29.43 51.31,28.53 STM32
F405RGT6.60
$1N2294: length 3.4
  Top Layer w0.203: 44.66,16.93 43.69,15.96 43.69,14.03 R2.2
$1N4386: length 2.2
  Top Layer w0.203: STM32
F405RGT6.31 45.06,15.21 C1.1
$1N4392: length 1.8
  Top Layer w0.203: STM32
F405RGT6.47 54.81,19.51 55.26,19.51
$1N4523: length 6.9
  Top Layer w0.254: C15.2 3.31,23.04 X2.1 4.35,20.6 CH345K.9
$1N4525: length 6.9
  Top Layer w0.254: CH345K.10 4.31,19.95 X2.2 3.31,17.54 C16.2
$1N4897: length 1.4
  Top Layer w0.254: R14.2 9.07,16.74 MOUT.2
$1N4901: length 1.4
  Top Layer w0.254: R15.2 10.56,16.74 MIN.2
$1N5032: length 1.5
  Top Layer w0.254: RDY.1 2.23,27.56 R13.1
$1N6007: length 3.1
  Top Layer w0.305: R6.1 R7.2 18.14,28.25 U2.5
$1N7140: length 4
  Top Layer w0.406: BUZ.2 33.78,14.19 Q2.3
$1N7141: length 1.2
  Top Layer w0.406: 39.86,13.3 39.85,13.29 38.71,13.29
$1N8066: length 1.4
  Top Layer w0.254: R19.1 36.22,25.91 TX.2
$1N8071: length 1.4
  Top Layer w0.254: R20.1 36.22,21.81 RX.2
$1N9517: length 1.5
  Top Layer w0.254: PWR.2 3.6,33.19 arc(3.58,33.12) R10.1
$1N12193: length 1.7
  Top Layer w0.254: 34.24,5.06 34.24,6.58 R22.2
$1N12501: length 1.7
  Top Layer w0.254: 58.62,5.06 58.62,6.58 R23.2
$1N12654: length 1.7
  Top Layer w0.254: 52.52,5.06 52.52,6.58 R24.2
$1N12806: length 1.7
  Top Layer w0.254: R25.2 46.43,6.58 46.43,5.06
$1N12958: length 1.7
  Top Layer w0.254: R26.2 40.33,6.58 40.33,5.06
$1N13110: length 1.7
  Top Layer w0.254: 3.76,5.06 3.76,6.58 R27.2
$1N13262: length 1.7
  Top Layer w0.254: 9.85,5.06 9.85,6.58 R28.2
$1N13414: length 1.7
  Top Layer w0.254: R29.2 15.95,6.58 15.95,5.06
$1N13566: length 1.7
  Top Layer w0.254: 22.04,5.06 22.04,6.58 R30.2
$1N13718: length 1.7
  Top Layer w0.254: 28.14,5.06 28.14,6.58 R31.2

## Copper pours and planes (outline as drawn; the poured copper is in the pictures)
3V3 on Top Layer: 32.77,22.7 32.89,22.57 35.05,22.57 35.18,22.7 35.18,24.98 35.05,25.11 33.02,25.11 32.77,24.85
3V3 on Top Layer: 20.07,24.6 19.81,24.35 19.81,23.58 20.07,23.33 21.46,23.33 21.72,23.08 21.72,22.19 21.84,22.06 22.73,22.06 22.86,22.19 22.86,23.08 23.11,23.33 24.51,23.33 24.89,23.71 24.89,24.47 24.51,24.85 21.46,24.85 21.21,24.6
3V3 on Top Layer: 40.13,27.9 40.51,28.28 41.66,28.28 42.29,27.65 42.29,27.27 41.02,26 41.02,25.62 40.97,25.57 40.74,25.8 40.31,25.8 40.31,27.09 40.13,27.27
5V on Top Layer: 17.91,32.09 17.91,30.95 18.29,30.57 19.3,30.57 19.69,30.19 19.69,27.65 19.94,27.39 20.45,27.39 21.34,28.28 21.34,31.71 20.7,32.35 18.16,32.35
GND on Top Layer: -1.02,40.73 70.99,40.73 70.99,-4.23 -1.02,-4.23
GND on Bottom Layer: -1.14,40.6 70.99,40.6 70.99,-4.48 -1.14,-4.48
TLV_EN on Top Layer: 16.26,24.22 16.26,23.71 15.37,22.82 15.37,21.93 15.49,21.81 19.18,21.81 19.3,21.93 19.3,22.82 19.05,23.08 17.65,23.08 17.27,23.46 17.27,24.33 17.24,24.36 16.4,24.36
$1N6012 on Top Layer: 19.81,26 21.34,27.52 24.13,27.52 24.38,27.27 24.38,26.25 24.13,26 21.72,26 20.57,24.85 19.94,24.85 19.81,24.98

Small or netless copper shapes (teardrops, artwork), in the pictures only: 403 on Top Layer, 71 on Bottom Layer

## Text on the board
Bottom Solder Mask Layer: v1.0 | Designed By WilliTourt | STM32F405RG Desktop DrumKit
